# EAGLE board BMS_25 (EAGLE 9.6.2)
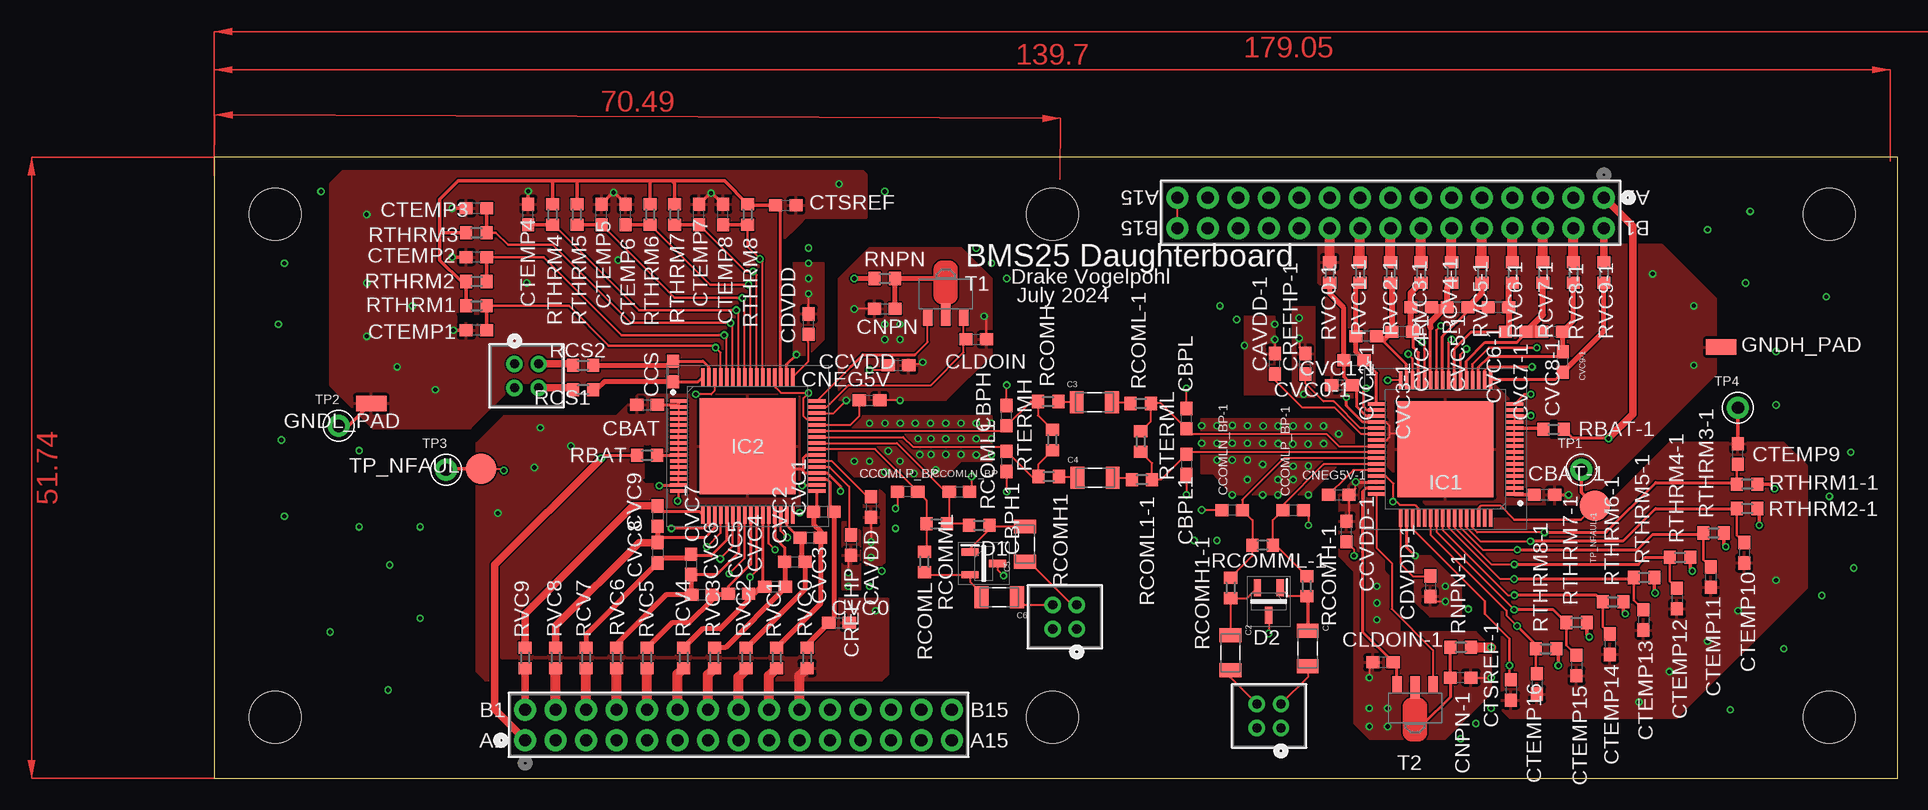
[diagram p1: board, top side]
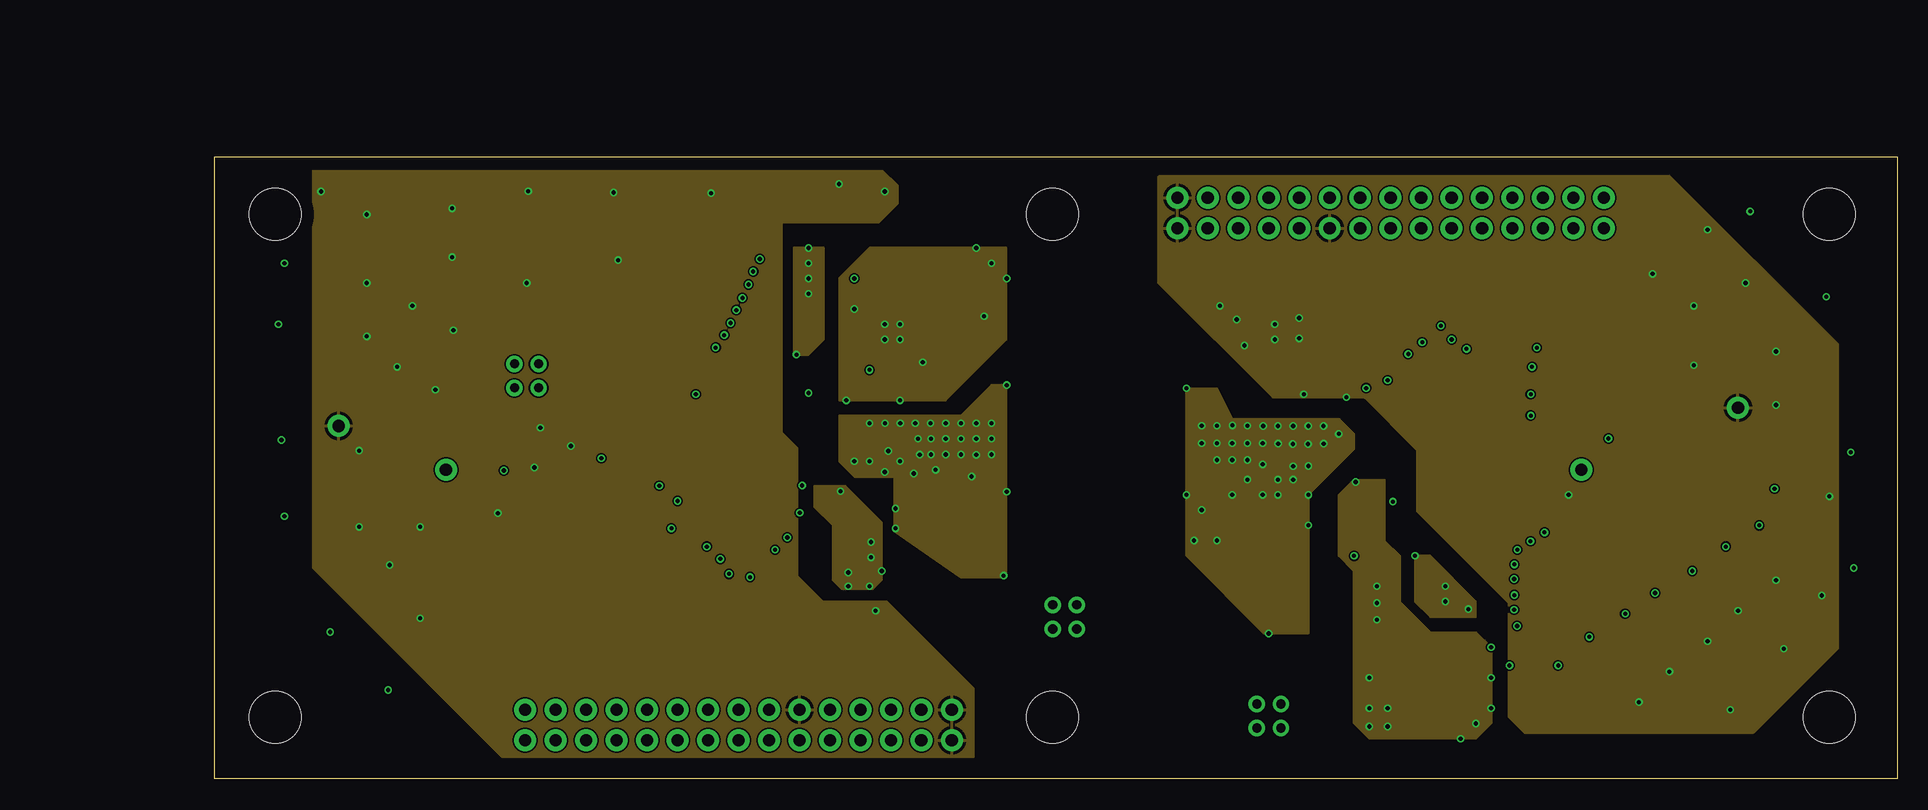
[diagram p2: board, inner layer Route2]
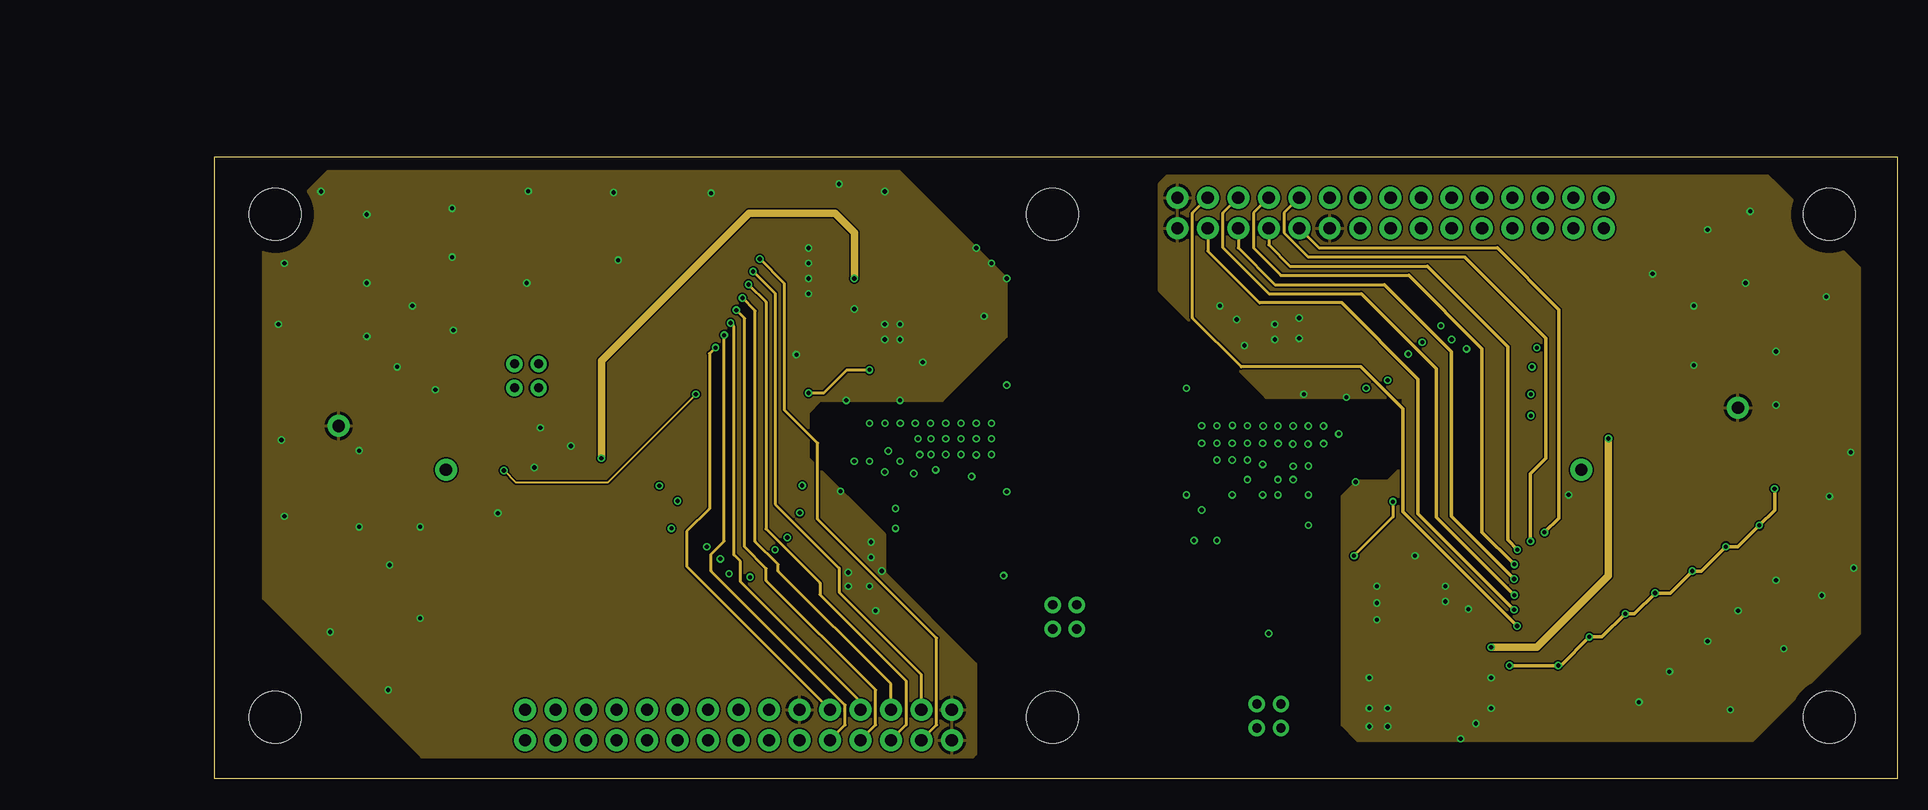
[diagram p3: board, inner layer Route15]
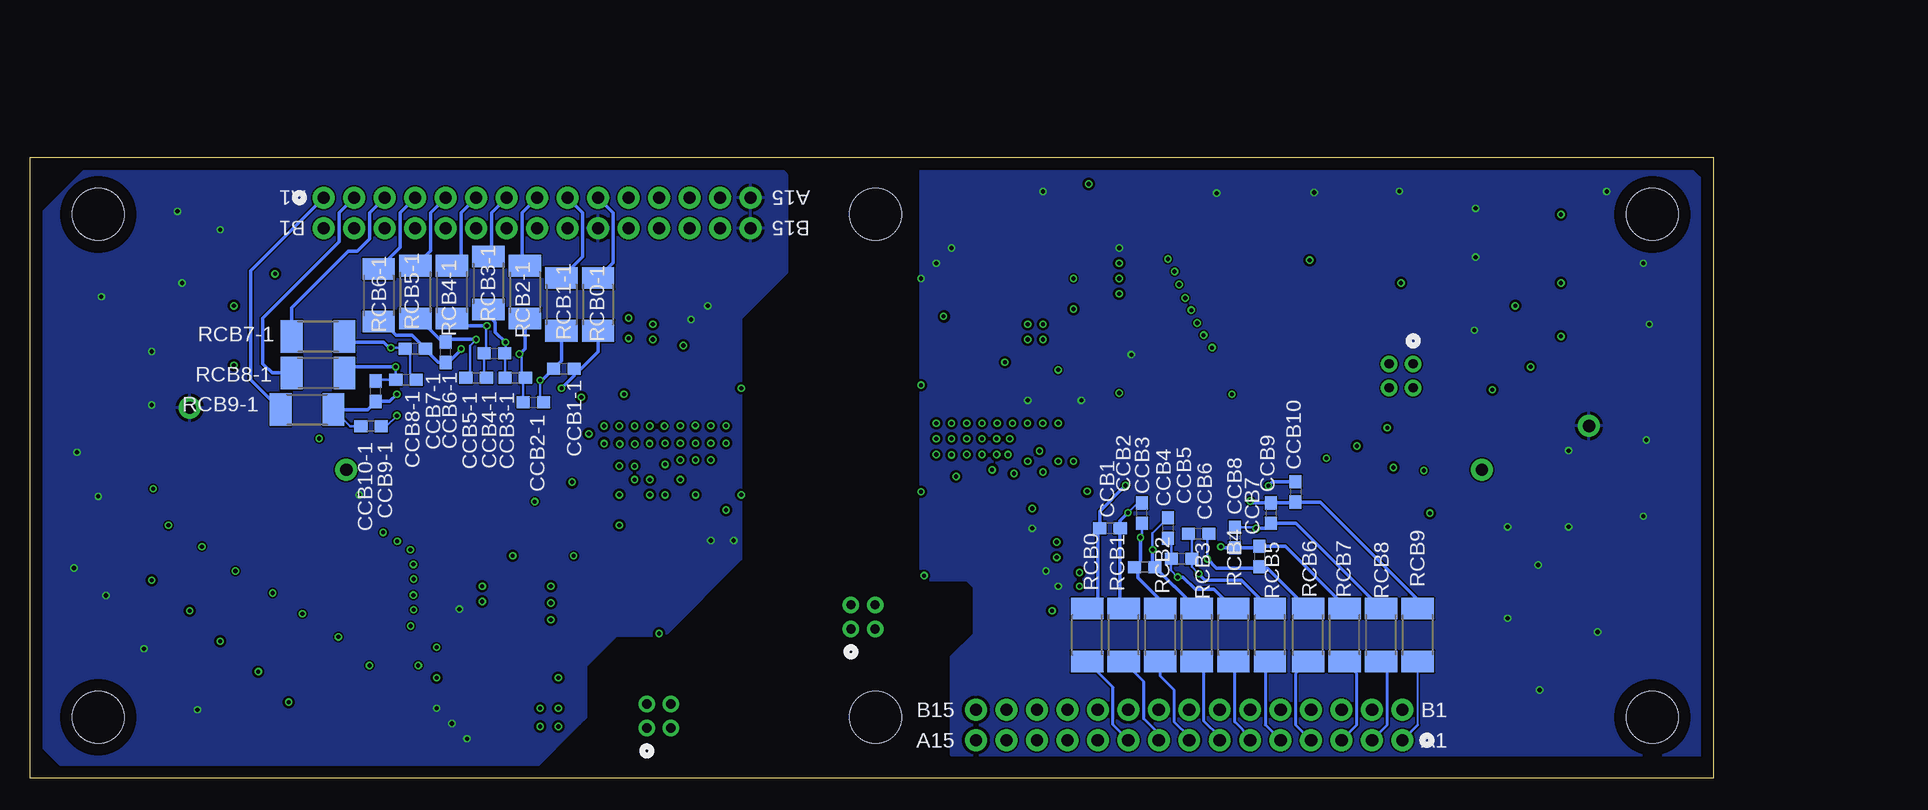
[diagram p4: board, bottom side, seen from below]

Size 140.31 x 51.74 mm. Coordinates in mm from the lower left corner, seen from the top.
Outline: 0,0 140.31,0 140.31,51.74 0,51.74 0,0
Copper layers (1+2*15+16): Top 0.035mm / dielectric 0.2mm / Route2 0.0175mm / dielectric 1.065mm / Route15 0.0175mm / dielectric 0.2mm / Bottom 0.035mm
Design rules "jlcpcb-4layers *": minimum track width 3.5mil, minimum drill 0.2mm, track to track 5mil, track to pad 0.2mm, pad to pad 5mil, via to via 0.5mm, smd to smd 5mil, copper to edge 40mil, drill to drill 6mil, minimum pad ring 10mil, minimum via ring 0.13mm, stop-mask expansion 0.05mm, vias tented up to drill 16mil, thermal gap 10mil
Holes 4.32 mm at 5.08,46.99 5.08,5.08 134.62,46.99 134.62,5.08 69.85,46.99 69.85,5.08
tRestrict: area 26.4,10.3 to 40.3,22.2; area 29,10.3 to 40.6,19.8; area 31.4,10.3 to 42.1,18.2; area 34.3,10.3 to 42.8,16.9; area 36.8,10.3 to 44.5,16.7; area 39.9,10.3 to 46.3,15.2; area 42.4,10.2 to 43.5,11.2; area 45,10.2 to 50.1,15.3; area 44.2,8.1 to 46.1,9.9; area 41.8,8.1 to 43.6,9.9; area 39.2,8.1 to 40.9,9.9; area 36.7,8.1 to 38.4,9.9; 10 more areas
bRestrict: area 58.2,29.3 to 58.7,29.8; area 59.4,29.3 to 59.9,29.8; area 60.7,29.3 to 61.2,29.8; area 62,29.3 to 62.5,29.8; area 63.2,29.3 to 63.8,29.8; area 64.5,29.3 to 65,29.8; area 64.5,28.1 to 65,28.6; area 55.6,29.3 to 56.1,29.8; area 56.9,29.3 to 57.4,29.8; area 54.4,29.3 to 54.9,29.8; area 60.7,28.1 to 61.2,28.6; area 62,28.1 to 62.5,28.6; 118 more areas

## Footprints (pad centres in the part's own frame; a part is rotated, then mirrored left to right if it is on the bottom)
CAPC3216X120N = smd 1.16 x 1.82: 1 -1.475,0; 2 1.475,0
C0603 = smd 1.1 x 1: 1 -0.85,0; 2 0.85,0
CON4_2X2_UF_DF11_HIR = drill 0.762 pad 1.27: 1 0,0; 2 0,2.007; 3 -2.007,0; 4 -2.007,2.007
SOT95P255X150-3N = smd 1.4 x 0.6: 1 -1.15,0.95; 2 -1.15,-0.95; 3 1.15,0
SMD1,27-2,54 = smd 1.27 x 2.54: 1 0,0
87606-315LF_AMP = drill 1.016 pad 1.524: 1 0,0; 2 2.54,0; 3 5.08,0; 4 7.62,0; 5 10.16,0; 6 12.7,0; 7 15.24,0; 8 17.78,0; 9 20.32,0; 10 22.86,0; 11 25.4,0; 12 27.94,0; 13 30.48,0; 14 33.02,0; 15 35.56,0; 16 0,2.54; 17 2.54,2.54; 18 5.08,2.54; 19 7.62,2.54; 20 10.16,2.54; 21 12.7,2.54; 22 15.24,2.54; 23 17.78,2.54; 24 20.32,2.54; 25 22.86,2.54; 26 25.4,2.54; 27 27.94,2.54; 28 30.48,2.54; 29 33.02,2.54; 30 35.56,2.54
QFP50P1200X1200X120-65N = smd 1.475 x 0.3: 1 -5.738,3.75; 2 -5.738,3.25; 3 -5.738,2.75; 4 -5.738,2.25; 5 -5.738,1.75; 6 -5.738,1.25; 7 -5.738,0.75; 8 -5.738,0.25; 9 -5.738,-0.25; 10 -5.738,-0.75; 11 -5.738,-1.25; 12 -5.738,-1.75; 13 -5.738,-2.25; 14 -5.738,-2.75; 15 -5.738,-3.25; 16 -5.738,-3.75; 33 5.738,-3.75; 34 5.738,-3.25; 35 5.738,-2.75; 36 5.738,-2.25; 37 5.738,-1.75; 38 5.738,-1.25; 39 5.738,-0.75; 40 5.738,-0.25; 41 5.738,0.25; 42 5.738,0.75; 43 5.738,1.25; 44 5.738,1.75; 45 5.738,2.25; 46 5.738,2.75; 47 5.738,3.25; 48 5.738,3.75 | smd 0.3 x 1.475: 17 -3.75,-5.738; 18 -3.25,-5.738; 19 -2.75,-5.738; 20 -2.25,-5.738; 21 -1.75,-5.738; 22 -1.25,-5.738; 23 -0.75,-5.738; 24 -0.25,-5.738; 25 0.25,-5.738; 26 0.75,-5.738; 27 1.25,-5.738; 28 1.75,-5.738; 29 2.25,-5.738; 30 2.75,-5.738; 31 3.25,-5.738; 32 3.75,-5.738; 49 3.75,5.738; 50 3.25,5.738; 51 2.75,5.738; 52 2.25,5.738; 53 1.75,5.738; 54 1.25,5.738; 55 0.75,5.738; 56 0.25,5.738; 57 -0.25,5.738; 58 -0.75,5.738; 59 -1.25,5.738; 60 -1.75,5.738; 61 -2.25,5.738; 62 -2.75,5.738; 63 -3.25,5.738; 64 -3.75,5.738 | smd 8 x 8: 65 0,0
R0603 = smd 1 x 1.1: 1 -0.85,0; 2 0.85,0
R2010 = smd 1.8 x 2.7: 1 -2.2,0; 2 2.2,0
SOT89-BCE = smd 0.8 x 1.4: B -1.499,-1.981; E 1.499,-1.981 | smd 0.8 x 1.9: C 0,-1.727
KEYSTONE_5002 = drill 1.02: TP 0,0
B2,54 = smd 2.54 x 2.54: TP 0,0

## Placement (x,y rotation side)
C1  C1206C105K5RACTU  [CAPC3216X120N]  91.14,10.82 270 top
C2  C1206C105K5RACTU  [CAPC3216X120N]  84.68,10.46 270 top
C3  C1206C105K5RACTU  [CAPC3216X120N]  73.36,31.34 0 top
C4  C1206C105K5RACTU  [CAPC3216X120N]  73.41,25.04 0 top
C5  C1206C105K5RACTU  [CAPC3216X120N]  67.56,19.51 90 top
C6  C1206C105K5RACTU  [CAPC3216X120N]  65.43,15.09 180 top
CAVDD  1uF  [C0603]  54.74,22.61 270 top
CAVDD-1  1uF  [C0603]  88.39,34.54 90 top
CBAT  10nF  [C0603]  36.07,31.11 0 top
CBAT-1  10nF  [C0603]  110.87,23.62 180 top
CBPH  220pF  [C0603]  66.04,30.23 90 top
CBPH1  220pF  [C0603]  66.04,26.42 270 top
CBPL  220pF  [C0603]  81.03,29.97 90 top
CBPL1  220pF  [C0603]  81.03,26.16 270 top
CCB1  0.47uF  [C0603]  50.29,20.83 180 bottom
CCB1-1  0.47uF  [C0603]  95.81,34.14 0 bottom
CCB2  0.47uF  [C0603]  47.62,22.1 90 bottom
CCB2-1  0.47uF  [C0603]  98.35,31.34 0 bottom
CCB3  0.47uF  [C0603]  47.4,17.6 180 bottom
CCB3-1  0.47uF  [C0603]  99.87,33.38 0 bottom
CCB4  0.47uF  [C0603]  45.44,20.85 90 bottom
CCB4-1  0.47uF  [C0603]  101.6,35.41 0 bottom
CCB5  0.47uF  [C0603]  44.32,18.29 180 bottom
CCB5-1  0.47uF  [C0603]  103.12,33.38 0 bottom
CCB6  0.47uF  [C0603]  42.9,20.37 180 bottom
CCB6-1  0.47uF  [C0603]  105.66,35.51 90 bottom
CCB7  0.47uF  [C0603]  37.85,18.49 270 bottom
CCB7-1  0.47uF  [C0603]  108.2,35.81 0 bottom
CCB8  0.47uF  [C0603]  39.88,20.07 270 bottom
CCB8-1  0.47uF  [C0603]  108.97,33.22 0 bottom
CCB9  0.47uF  [C0603]  36.88,22.1 270 bottom
CCB9-1  0.47uF  [C0603]  111.51,32.26 90 bottom
CCB10  0.47uF  [C0603]  34.82,23.88 270 bottom
CCB10-1  0.47uF  [C0603]  111.89,29.34 180 bottom
CCOMLN_BP  220pF  [C0603]  62.1,23.88 0 top
CCOMLN_BP-1  220pF  [C0603]  84.84,22.35 180 top
CCOMLP_BP  220pF  [C0603]  57.78,23.88 180 top
CCOMLP_BP-1  220pF  [C0603]  89.92,22.35 0 top
CCS  0.47uF  [C0603]  38.23,33.91 270 top
CCVDD  4.7uF  [C0603]  57.02,34.42 0 top
CCVDD-1  4.7uF  [C0603]  94.36,20.57 90 top
CDVDD  1uF  [C0603]  49.53,37.85 90 top
CDVDD-1  1uF  [C0603]  101.35,16 270 top
CLDOIN  0.1uF  [C0603]  63.5,36.58 0 top
CLDOIN-1  0.1uF  [C0603]  97.41,9.65 180 top
CNEG5V  0.1uF  [C0603]  54.61,31.5 0 top
CNEG5V-1  0.1uF  [C0603]  93.73,23.62 0 top
CNPN  0.22uF  [C0603]  55.88,39.12 0 top
CNPN-1  0.22uF  [C0603]  103.89,8.38 180 top
COMMH  DF11-4DP-2DSA(24)  [CON4_2X2_UF_DF11_HIR]  88.9,4.19 0 top
COMML  DF11-4DP-2DSA(24)  [CON4_2X2_UF_DF11_HIR]  71.88,12.45 0 top
CREFHP  1uF  [C0603]  53.09,19.43 270 top
CREFHP-1  1uF  [C0603]  90.93,34.54 90 top
CTEMP1  0.47uF  [C0603]  21.84,37.34 180 top
CTEMP2  0.47uF  [C0603]  21.84,43.43 180 top
CTEMP3  0.47uF  [C0603]  21.84,47.5 180 top
CTEMP4  0.47uF  [C0603]  26.16,46.99 90 top
CTEMP5  0.47uF  [C0603]  32.26,46.99 90 top
CTEMP6  0.47uF  [C0603]  34.29,46.99 90 top
CTEMP7  0.47uF  [C0603]  40.39,46.99 90 top
CTEMP8  0.47uF  [C0603]  42.42,46.99 90 top
CTEMP9  0.47uF  [C0603]  127,27.03 90 top
CTEMP10  0.47uF  [C0603]  127.51,18.8 270 top
CTEMP11  0.47uF  [C0603]  124.71,16.76 270 top
CTEMP12  0.47uF  [C0603]  121.92,14.99 270 top
CTEMP13  0.47uF  [C0603]  119.13,13.21 270 top
CTEMP14  0.47uF  [C0603]  116.33,11.18 270 top
CTEMP15  0.47uF  [C0603]  113.54,9.4 270 top
CTEMP16  0.47uF  [C0603]  110.24,7.87 270 top
CTSREF  1uF  [C0603]  47.62,47.75 0 top
CTSREF-1  1uF  [C0603]  108.08,7.37 270 top
CVC0  0.47uF  [C0603]  52.07,12.95 0 top
CVC0-1  0.47uF  [C0603]  93.98,32.77 180 top
CVC1  0.47uF  [C0603]  50.8,22.23 0 top
CVC1-1  0.47uF  [C0603]  95,34.82 180 top
CVC2  0.47uF  [C0603]  49.66,20.07 0 top
CVC2-1  0.47uF  [C0603]  96.01,36.86 180 top
CVC3  0.47uF  [C0603]  48.39,18.03 0 top
CVC3-1  0.47uF  [C0603]  99.01,37.21 180 top
CVC4  0.47uF  [C0603]  46.74,15.98 0 top
CVC4-1  0.47uF  [C0603]  100.58,39.24 180 top
CVC5  0.47uF  [C0603]  43.69,15.37 0 top
CVC5-1  0.47uF  [C0603]  103.63,39.24 180 top
CVC6  0.47uF  [C0603]  40.64,15.32 0 top
CVC6-1  0.47uF  [C0603]  107.04,39.24 180 top
CVC7  0.47uF  [C0603]  39.75,17.83 270 top
CVC7-1  0.47uF  [C0603]  108.46,37.21 180 top
CVC8  0.47uF  [C0603]  36.96,18.8 270 top
CVC8-1  0.47uF  [C0603]  111.51,37.21 180 top
CVC9  0.47uF  [C0603]  36.96,21.84 270 top
CVC9-1  0.47uF  [C0603]  112.39,34.7 90 top
D1  ESDAVLC6-2BLY  [SOT95P255X150-3N]  64.14,17.91 0 top
D2  ESDAVLC6-2BLY  [SOT95P255X150-3N]  87.88,14.73 270 top
GNDH_PAD  [SMD1,27-2,54]  125.6,35.94 270 top
GNDL_PAD  [SMD1,27-2,54]  13.08,31.24 90 top
HIGH-IN  87606-315LF  [87606-315LF_AMP]  115.82,48.39 180 top
IC1  PBQ79656PAPTQ1  [QFP50P1200X1200X120-65N]  102.62,27.43 180 top
IC2  PBQ79656PAPTQ1  [QFP50P1200X1200X120-65N]  44.45,27.69 0 top
LOW-IN  87606-315LF  [87606-315LF_AMP]  25.91,3.17 0 top
RBAT  30  [R0603]  36.07,26.92 0 top
RBAT-1  30  [R0603]  111.63,29.08 180 top
RCB0  10  [R2010]  52.2,11.94 90 bottom
RCB0-1  10  [R2010]  92.96,39.5 270 bottom
RCB1  10  [R2010]  49.15,11.94 90 bottom
RCB1-1  10  [R2010]  96.01,39.5 270 bottom
RCB2  10  [R2010]  46.1,11.94 90 bottom
RCB2-1  10  [R2010]  99.06,40.51 270 bottom
RCB3  10  [R2010]  43.05,11.94 90 bottom
RCB3-1  10  [R2010]  102.11,41.27 270 bottom
RCB4  10  [R2010]  40.01,11.94 90 bottom
RCB4-1  10  [R2010]  105.16,40.51 270 bottom
RCB5  10  [R2010]  36.96,11.94 90 bottom
RCB5-1  10  [R2010]  108.2,40.51 270 bottom
RCB6  10  [R2010]  33.78,11.94 90 bottom
RCB6-1  10  [R2010]  111.25,40.26 270 bottom
RCB7  10  [R2010]  30.73,11.94 90 bottom
RCB7-1  10  [R2010]  116.31,36.83 0 bottom
RCB8  10  [R2010]  27.69,11.94 90 bottom
RCB8-1  10  [R2010]  116.31,33.78 0 bottom
RCB9  10  [R2010]  24.64,11.94 90 bottom
RCB9-1  10  [R2010]  117.22,30.73 0 bottom
RCOMH  49  [R0603]  69.49,31.39 180 top
RCOMH1  49  [R0603]  69.55,25.15 180 top
RCOMH1-1  49  [R0603]  84.71,15.88 90 top
RCOMH-1  49  [R0603]  91.06,16 90 top
RCOML  49  [R0603]  59.18,18.03 90 top
RCOML1  49  [R0603]  63.75,21.08 180 top
RCOML1-1  49  [R0603]  77.32,24.89 0 top
RCOML-1  49  [R0603]  77.22,31.24 0 top
RCOMML  1k  [R0603]  60.2,21.21 0 top
RCOMML-1  1k  [R0603]  87.38,19.43 0 top
RCS1  10  [R0603]  30.73,32.38 180 top
RCS2  10  [R0603]  30.73,34.42 180 top
RCV4  100  [R0603]  39.12,10.03 90 top
RCV4-1  100  [R0603]  103.12,42.16 270 top
RCV7  100  [R0603]  30.99,10.03 90 top
RCV7-1  100  [R0603]  110.74,42.16 270 top
RNPN  49?  [R0603]  55.88,41.66 0 top
RNPN-1  49?  [R0603]  103.89,10.92 180 top
RTERMH  1k  [R0603]  69.85,28.19 90 top
RTERML  1k  [R0603]  77.22,28.07 270 top
RTHRM1  10k  [R0603]  21.84,39.37 0 top
RTHRM1-1  10k  [R0603]  127.76,24.51 180 top
RTHRM2  10k  [R0603]  21.84,41.4 0 top
RTHRM2-1  10k  [R0603]  127.76,22.48 180 top
RTHRM3  10k  [R0603]  21.84,45.47 0 top
RTHRM3-1  10k  [R0603]  124.97,20.45 180 top
RTHRM4  10k  [R0603]  28.19,46.99 270 top
RTHRM4-1  10k  [R0603]  122.17,18.41 180 top
RTHRM5  10k  [R0603]  30.23,46.99 270 top
RTHRM5-1  10k  [R0603]  119.18,16.74 180 top
RTHRM6  10k  [R0603]  36.32,46.99 270 top
RTHRM6-1  10k  [R0603]  116.59,14.71 180 top
RTHRM7  10k  [R0603]  38.35,46.99 270 top
RTHRM7-1  10k  [R0603]  113.54,12.98 180 top
RTHRM8  10k  [R0603]  44.45,46.99 270 top
RTHRM8-1  10k  [R0603]  111,10.79 180 top
RVC0  100  [R0603]  49.4,10.03 90 top
RVC0-1  100  [R0603]  92.96,42.16 270 top
RVC1  100  [R0603]  46.86,10.03 90 top
RVC1-1  100  [R0603]  95.5,42.16 270 top
RVC2  100  [R0603]  44.32,10.03 90 top
RVC2-1  100  [R0603]  98.04,42.16 270 top
RVC3  100  [R0603]  41.68,10.03 90 top
RVC3-1  100  [R0603]  100.58,42.16 270 top
RVC5  100  [R0603]  36.07,10.03 90 top
RVC5-1  100  [R0603]  105.66,42.16 270 top
RVC6  100  [R0603]  33.53,10.03 90 top
RVC6-1  100  [R0603]  108.2,42.16 270 top
RVC8  100  [R0603]  28.45,10.03 90 top
RVC8-1  100  [R0603]  113.28,42.16 270 top
RVC9  100  [R0603]  25.91,10.03 90 top
RVC9-1  100  [R0603]  115.82,42.16 270 top
SR  DF11-4DP-2DSA(24)  [CON4_2X2_UF_DF11_HIR]  25.02,34.54 180 top
T1  PBHV8115X, 115  [SOT89-BCE]  60.96,40.39 0 top
T2  PBHV8115X, 115  [SOT89-BCE]  100.08,5.84 180 top
TP1  5002  [KEYSTONE_5002]  113.94,25.7 0 top
TP2  5002  [KEYSTONE_5002]  10.36,29.36 0 top
TP3  5002  [KEYSTONE_5002]  19.3,25.7 0 top
TP4  5002  [KEYSTONE_5002]  127,30.89 0 top
TP_NFAUL  TPB2,54  [B2,54]  22.23,25.78 180 top
TP_NFAUL-1  TPB2,54  [B2,54]  115.06,22.73 0 top

## Tracks (layer width: path | path; a pad name or v marks a point on that pad's centre or on a via)
AVDD
  Top 0.152: IC2.38 51.47,26.44 54.44,23.46 CAVDD.1
AVDD-1
  Top 0.152: IC1.38 95.61,28.68 93.38,30.9 90.68,30.9 88.39,33.19 CAVDD-1.1
BAT  (via drill 0.35)
  Top 0.254: v32.26,26.67 32.51,26.92 RBAT.1
  Top 0.406: v53.34,41.66 RNPN.1
  Top 0.61: v32.26,26.67 23.37,17.78 23.37,5.77 25.91,3.23 LOW-IN.1
  Route15 0.61: v32.26,26.67 32.26,34.8 44.55,47.09 51.71,47.09 53.34,45.47 v53.34,41.66
  Bottom 0.152: 24.64,4.45 RCB9.1
  Bottom 0.254: LOW-IN.1 24.64,4.45
BAT-1  (via drill 0.35)
  Top 0.254: RBAT-1.1 113.25,28.32 v116.2,28.32
  Top 0.61: v116.2,28.32 118.24,30.35 118.24,46.02 115.88,48.39 HIGH-IN.1
  Top 0.813: RNPN-1.1 v106.43,10.92
  Route15 0.61: v106.43,10.92 110.24,10.92 116.2,16.89 v116.2,28.32
  Bottom 0.305: HIGH-IN.1 121.92,42.29 121.92,33.23 RCB9-1.1
CB0  (via drill 0.35)
  Top 0.2: IC2.34 49.02,24.44 v49,24.41
  Bottom 0.152: 51.14,21.04 CCB1.2
  Bottom 0.305: RCB0.2 51.31,15.03 51.31,20.66 CCB1.2 | 51.14,21.04 51.14,22.26 v49,24.41
CB0-1  (via drill 0.35)
  Top 0.203: v96.01,32.51 95.76,32.26 95.76,30.99 96.06,30.68 IC1.34
  Bottom 0.305: RCB0-1.2 92.96,35.56 94.39,34.14 CCB1-1.2 94.96,33.56 v96.01,32.51
CB0-IN
  Bottom 0.254: LOW-IN.10 50.04,4.45 50.04,7.58 RCB0.1
CB0-IN-1
  Bottom 0.305: RCB0-1.1 91.7,42.96 91.7,44.2 91.7,47.12 HIGH-IN.10
CB1  (via drill 0.35)
  Top 0.2: IC2.32 48.38,22.13 v48.79,22.13 v48.79,22.12
  Bottom 0.203: v48.79,22.12 47.97,22.95 CCB2.2
  Bottom 0.305: v48.79,22.12 49.44,21.48 CCB1.1 49.44,14.43 RCB1.2
CB1-1  (via drill 0.35)
  Top 0.152: IC1.32 v97.79,33.17
  Bottom 0.203: CCB2-1.2 97.8,31.65 97.8,33.16 v97.79,33.17
  Bottom 0.305: v97.79,33.17 97.62,33.17 CCB1-1.1 96.01,34.78 RCB1-1.2
CB1-IN
  Bottom 0.254: LOW-IN.9 46.23,3.71 47.47,4.95 47.47,8.06 RCB1.1
CB1-IN-1
  Bottom 0.305: RCB1-1.1 94.24,43.47 94.24,47.12 HIGH-IN.9
CB2  (via drill 0.35)
  Top 0.2: IC2.30 47.2,20.62 v47.75,20.07
  Bottom 0.203: v47.75,20.07 47.62,20.19 CCB2.1
  Bottom 0.305: RCB2.2 46.1,14.86 47.94,16.7 47.94,17.3 CCB3.2 47.75,18.1 v47.75,20.07
CB2-1  (via drill 0.35)
  Top 0.203: v99.52,35.36 99.52,35.3 99.87,34.95 IC1.30
  Bottom 0.203: CCB2-1.1 99.2,33.2 CCB3-1.2 99.33,33.68 99.33,35.17 v99.52,35.36
  Bottom 0.305: v99.52,35.36 99.06,35.81 RCB2-1.2
CB2-IN
  Bottom 0.254: LOW-IN.8 43.69,3.45 44.93,4.69 44.93,7.34 46.1,8.51 RCB2.1
CB2-IN-1
  Bottom 0.305: RCB2-1.1 99.31,42.97 99.31,47.12 HIGH-IN.8
CB3  (via drill 0.35)
  Top 0.2: IC2.28 46.2,19.59 v46.74,19.05
  Bottom 0.203: v46.74,19.05 46.74,20.41 CCB4.2
  Bottom 0.305: v46.74,19.05 46.74,17.79 CCB3.1 44.95,16 44.92,16 RCB3.2
CB3-1  (via drill 0.35)
  Top 0.203: v100.68,36.34 100.87,36.16 IC1.28
  Bottom 0.203: v100.68,36.34 100.68,35.48 CCB4-1.2 100.72,35.38 CCB3-1.1
  Bottom 0.305: v100.68,36.34 101.53,37.19 101.53,38.01 102.11,38.59 RCB3-1.2
CB3-IN
  Bottom 0.254: LOW-IN.7 41.15,3.45 42.45,4.75 42.45,9.13 RCB3.1
CB3-IN-1
  Bottom 0.305: RCB3-1.1 101.85,43.73 101.85,47.12 HIGH-IN.7
CB4  (via drill 0.35)
  Top 0.2: IC2.26 45.2,17.31 v44.65,16.76
  Bottom 0.203: v44.65,16.76 45.21,17.32 45.21,18.25 CCB5.2 45.17,19.74 CCB4.1
  Bottom 0.305: RCB4.2 41.62,15.75 43.18,15.75 44.2,16.76 v44.65,16.76
CB4-1  (via drill 0.35)
  Top 0.152: IC1.26 101.87,33.96
  Top 0.203: 101.87,33.96 101.87,37.34 v102.24,37.72
  Bottom 0.203: v102.24,37.72 102.29,37.66 102.29,35.57 | CCB5-1.2 102.45,33.55 CCB4-1.1
  Bottom 0.305: v102.24,37.72 104.56,37.72 RCB4-1.2 | 102.29,35.57 CCB4-1.1
CB4-IN
  Bottom 0.254: LOW-IN.6 38.61,3.43 39.88,4.7 39.88,9.61 RCB4.1
CB4-IN-1
  Bottom 0.305: RCB4-1.1 104.39,43.48 104.39,47.12 HIGH-IN.6
CB5  (via drill 0.35)
  Top 0.2: IC2.24 44.2,18.34 v42.9,17.04
  Bottom 0.203: v42.9,17.04 43.47,17.61 CCB5.1 43.47,20.09 CCB6.2
  Bottom 0.305: RCB5.2 39.33,16.51 42.37,16.51 v42.9,17.04
CB5-1  (via drill 0.35)
  Top 0.203: v103.12,36.58 102.87,36.32 IC1.24
  Bottom 0.203: CCB5-1.1 103.63,33.72 103.63,36.07 v103.12,36.58
  Bottom 0.305: v103.12,36.58 105.45,36.58 CCB6-1.2 105.86,36.55 106.14,36.55 107.9,38.31 RCB5-1.2
CB5-IN
  Bottom 0.254: LOW-IN.5 37.34,4.45 37.34,9.36 RCB5.1
CB5-IN-1
  Bottom 0.305: RCB5-1.1 106.93,43.98 106.93,47.12 HIGH-IN.5
CB6  (via drill 0.35)
  Top 0.2: IC2.22 43.2,19.32 v42.16,18.29
  Bottom 0.203: v42.16,18.29 42.16,20.26 CCB6.1
  Bottom 0.305: RCB6.2 37.17,17.53 37.73,17.53 CCB7.2 37.96,17.53 41.4,17.53 v42.16,18.29
CB6-1  (via drill 0.35)
  Top 0.152: IC1.22 103.87,33.96
  Top 0.203: 103.87,33.96 103.87,35.28 v104.37,35.79
  Bottom 0.305: RCB6-1.2 110.95,38.06 109.8,36.91 108.45,36.91 CCB7-1.2 107.35,35.73 106.29,34.66 CCB6-1.1 105.41,34.66 104.37,35.7 v104.37,35.79
CB6-IN
  Bottom 0.254: RCB6.1 34.83,8.69 34.83,4.47 LOW-IN.4
CB6-IN-1
  Bottom 0.305: RCB6-1.1 109.47,44.24 109.47,47.12 HIGH-IN.4
CB7  (via drill 0.35)
  Top 0.2: IC2.20 42.2,20.45 v41.05,19.3
  Bottom 0.305: RCB7.2 30.73,14.39 35.68,19.34 CCB7.1 37.97,19.22 CCB8.2 40.97,19.22 v41.05,19.3
CB7-1  (via drill 0.35)
  Top 0.203: v110.24,35.88 106.24,35.88 104.87,34.5 IC1.20
  Bottom 0.203: v110.24,35.88 109.12,35.88 CCB7-1.1 108.62,35.38 108.62,33.73 CCB8-1.2
  Bottom 0.305: v110.24,35.88 110.31,35.8 110.83,36.32 113.6,36.32 RCB7-1.2
CB7-IN
  Bottom 0.254: LOW-IN.3 29.72,4.45 29.72,8.72 RCB7.1
CB7-IN-1
  Bottom 0.305: HIGH-IN.3 112.01,47.12 112.01,44.96 113.03,43.94 113.79,43.94 118.51,39.23 RCB7-1.1
CB8  (via drill 0.35)
  Top 0.2: IC2.18 41.2,21.13 40.89,20.83 v38.1,20.83
  Bottom 0.203: v38.1,20.83 38.19,20.92 CCB8.1
  Bottom 0.305: v38.1,20.83 37.3,20.83 CCB9.2 34.8,21.25 RCB8.2
CB8-1  (via drill 0.35)
  Top 0.152: IC1.18 105.87,33.96
  Top 0.203: 105.87,33.96 105.87,33.98 106.17,34.29 v109.83,34.29
  Bottom 0.203: CCB9-1.2 111.39,33.22 CCB8-1.1 109.82,34.28 v109.83,34.29
  Bottom 0.305: v109.83,34.29 113.6,34.29 RCB8-1.2
CB8-IN
  Bottom 0.254: LOW-IN.2 27.18,4.45 27.18,9.23 RCB8.1
CB8-IN-1
  Bottom 0.305: HIGH-IN.2 114.55,47.12 114.55,44.7 120.9,38.35 120.9,34.54 120.14,33.78 RCB8-1.1
CB9  (via drill 0.35)
  Top 0.2: IC2.16 38.71,23.22 v38.61,23.11
  Bottom 0.305: v38.61,23.11 38.44,22.95 CCB9.1 34.9,22.95 CCB10.2 32.76,23.03 24.64,14.9 RCB9.2
CB9-1  (via drill 0.35)
  Top 0.203: IC1.16 109.18,32 v109.73,32
  Bottom 0.203: RCB9-1.2 113.62,29.34 CCB10-1.2
  Bottom 0.305: v109.73,32 110.32,31.41 CCB9-1.1 112.18,30.73 RCB9-1.2
COMHN
  Top 0.152: RTERMH.1 68.69,26.19 RCOMH1.2 68.16,25.15 CBPH1.1 65.67,27.64 58.22,27.64 57.42,28.44 IC2.42
COMHN-1
  Top 0.152: IC1.42 89.17,26.68 85.69,23.2 CCOMLN_BP-1.1 86.53,21.51 RCOMML-1.1 86.53,18.54 RCOMH1-1.2
COMHP
  Top 0.152: RTERMH.2 68.64,30.25 RCOMH.2 68.06,31.39 CBPH.1 65.6,28.94 IC2.43
COMHP-1
  Top 0.152: IC1.43 96.86,26.16 92.46,26.16 89.07,22.77 CCOMLP_BP-1.1 88.23,21.51 RCOMML-1.2 88.48,19.43 RCOMH-1.2
COMLN
  Top 0.152: IC2.41 56.9,27.94 61.11,23.73 CCOMLN_BP.1 61.25,21.25 61.21,21.21 | RCOML1.2 62.78,21.21 61.21,21.21 | 61.21,21.21 RCOMML.2
COMLN-1
  Top 0.152: RTERML.2 78.17,26.27 RCOML1-1.2 78.91,24.89 CBPL1.1 81.2,27.18 IC1.41
COMLP
  Top 0.152: IC2.40 55.08,27.44 CCOMLP_BP.1 59.35,23.16 RCOMML.1 59.35,19.05 RCOML.2
COMLP-1
  Top 0.152: RTERML.1 78.07,29.77 RCOML-1.2 78.91,31.24 CBPL.1 81.45,28.7 92.71,28.7 93.73,27.68 IC1.40
CVDD  (via drill 0.35)
  Top 0.152: IC2.45 49.36,29.93 49.09,30.19 49.09,31.68 v49.53,32.12 | CCVDD.1 55.79,34.04 v54.61,34.04 | v49.53,32.12 | IC2.52 46.77,33.35 46.77,32.57 47.23,32.12 v49.53,32.12
  Route15 0.254: v49.53,32.12 50.8,32.12 52.72,34.04 v54.61,34.04
CVDD-1  (via drill 0.35)
  Top 0.152: 98.29,23.24 98.29,24.56 97.67,25.18 IC1.45 | IC1.52 100.37,22.48 100.06,22.79 98.81,22.79 98.32,23.27 98.29,23.24 | CCVDD-1.1 95,19.09 v95,18.54 | v98.24,23.06 98.24,23.19 98.29,23.24
  Route15 0.254: v95,18.54 98.24,21.79 v98.24,23.06
DVDD
  Top 0.152: IC2.49 49.47,34.69 49.47,36.37 CDVDD.1
DVDD-1
  Top 0.152: IC1.49 98.87,17.89 99.9,16.85 CDVDD-1.1
GNDH  (via drill 0.35)
  Top 0.152: 97.95,28.7 97.95,29.4 97.67,29.68 IC1.36 | 97.95,28.7 97.95,28.41 97.72,28.18 IC1.39 | 97.95,28.7 98.81,28.7 100.08,27.43 IC1.65 | v95.12,24.69 95.12,24.17 CNEG5V-1.2 94.58,21.64 CCVDD-1.2 | CNPN-1.1 v106.43,8.38 | v102.62,14.73 101.77,14.73 CDVDD-1.2 | v90.42,36.66 90.42,35.9 CREFHP-1.2 | CBPL1.2 v81.03,23.62 | CCOMLN_BP-1.2 v82.3,22.35 | CCOMLP_BP-1.2 91.19,21.93 v91.19,21.08 | v88.39,36.58 CAVDD-1.2 | D2.3 v87.88,12.06 | CBPL.2 v81.03,32.51 | CLDOIN-1.2 96.27,9.36 v96.27,8.38 | HIGH-IN.30 HIGH-IN.15
  Top 0.254: IC1.36 95.74,29.68 94.36,31.06 v94.36,31.75 | IC1.46 v95.13,24.68 v95.12,24.69 | IC1.50 99.37,19.25 v100.08,18.54 | CBAT-1.1 v112.88,23.62
  Top 0.305: CTEMP9.2 TP4.TP
  Top 0.813: RVC0-1.1 HIGH-IN.25
  other vias: 84.86,29.41 86.11,29.39 83.57,29.39 82.3,29.39 88.65,29.37 89.92,29.37 91.18,29.37 86.11,26.52 84.84,26.52 83.57,26.52 82.3,27.92 83.57,27.92 87.38,26.16 86.11,24.89 84.84,23.62 84.84,27.92 86.11,27.92 87.43,29.36 88.67,27.89 89.89,27.86 87.38,27.92 92.45,29.37 91.16,27.86 92.46,27.89 87.38,23.62 88.65,24.89 89.92,26 89.92,24.89 88.65,23.62 91.19,26.02 91.19,23.62 104.52,14.1 85.22,38.23 85.85,36.07 88.39,37.85 90.42,38.35 90.81,32 106.43,5.84 105.16,4.57 102.62,16 103.89,3.3 96.9,13.21 96.9,14.61 96.9,16 96.27,5.84 97.79,5.84 97.79,4.32 96.27,4.32 93.73,28.7 81.66,19.81 83.57,19.81 118.75,6.35 121.28,8.89 124.46,11.43 126.36,5.71 130.81,10.79 133.99,15.24 130.18,16.51 127,13.97 134.62,23.5 130.18,31.11 123.32,34.42 123.32,39.37 130.18,35.56 127.64,41.27 119.89,42.04 124.46,45.72 83.82,39.37 136.65,17.53 136.4,27.18 134.37,40.13 128.02,47.24
  pour Top: 89.92,31.75 89.92,39.31 91.69,39.31 91.69,31.75
  pour Top: 88.39,32 88.39,38.48 85.85,38.48 85.85,32
  pour Top: 82.3,29.97 93.73,29.97 95,28.7 95,27.43 91.19,23.62 84.86,23.62 83.31,25.4 82.3,25.4
  pour Top: 95,24.89 93.73,23.62 93.73,18.54 95,17.27 95,4.57 96.27,3.3 102.62,3.3 106.43,7.11 106.43,10.92 105.16,12.19 98.81,12.19 98.81,16 97.54,17.27 97.54,24.89
  pour Top: 100.08,18.54 101.35,18.54 103.89,16 103.89,13.46 101.35,13.46 100.08,14.73
  pour Route2: 100.08,18.54 100.08,14.73 101.35,13.46 105.16,13.46 105.16,14.73 101.35,18.54
  pour Route2: 105.16,12.19 106.43,10.92 106.43,4.57 105.16,3.3 96.27,3.3 95,4.57 95,17.27 93.73,18.54 93.73,23.62 95,24.89 97.54,24.89 97.54,19.81 98.81,18.54 98.81,14.73 101.35,12.19
  pour Route2: 81.03,32.51 83.57,32.51 84.84,29.97 93.73,29.97 95,28.7 95,27.43 91.19,23.62 91.19,12.06 87.5,12.06 81.03,18.54
  pour Top: 100.97,21.59 100.97,20.95 107.31,14.61 107.31,5.71 107.95,5.08 121.92,5.08 132.72,15.88 132.72,26.04 130.81,27.94 121.28,27.94 114.94,21.59
  pour Top: 113.67,22.86 100.97,22.86 97.16,26.67 97.16,30.48 95.89,31.75 92.71,31.75 92.71,40.64 92.08,41.27 92.08,44.45 120.65,44.45 125.09,40.01 125.09,33.66 116.2,24.77 114.3,22.86
  pour Route2: 95.89,31.75 88.27,31.75 78.74,41.27 78.74,50.16 121.28,50.16 135.25,36.2 135.25,10.79 128.27,3.81 109.22,3.81 107.95,5.08 107.95,14.61 100.33,22.23 100.33,27.3
  pour Route15: 96.52,3.17 128.27,3.17 137.16,12.06 137.16,42.55 130.18,49.53 129.54,50.16 79.38,50.16 78.74,49.53 78.74,40.64 87.63,31.75 99.06,31.75 99.06,26.04 97.79,24.77 95.25,24.77 93.98,23.5 93.98,4.45 95.25,3.17
  pour Bottom: 81.03,18.54 81.03,38.35 79.76,39.62 77.22,42.16 77.22,50.29 77.72,50.8 85.09,50.8 135.64,50.8 139.95,46.48 139.95,3.3 137.16,0.51 98.55,0.51 94.49,4.57 93.98,5.08 93.98,9.4 91.44,11.94 87.38,11.94 81.03,18.29
GNDL  (via drill 0.35)
  Top 0.152: CNPN.1 v53.34,39.12 | CLDOIN.2 64.35,38.32 v64.16,38.51 | v57.15,31.5 CNEG5V.2 | CCVDD.2 57.96,34.5 58.88,34.5 v59.05,34.67 | IC2.46 51.62,30.44 v52.68,31.5 | CDVDD.2 v49.53,40.39 | v56.77,22.48 56.94,22.64 CCOMLP_BP.2 | CCOMLN_BP.2 63.12,24.04 v63.12,25.15 | D1.3 65.28,17.39 v65.79,16.89 | CBPH.2 v66.04,32.77 | CBPH1.2 v66.04,23.88 | CREFHP.2 52.83,18.33 v52.83,17.14 | CAVDD.2 v54.74,19.68 | IC2.65 45.09,27.69 46.99,25.78
  Top 0.254: IC2.50 47.7,34.49 v48.51,35.31 | v52.2,23.93 52.2,24.34 51.1,25.44 IC2.36 49.23,25.43 49.12,25.54 | 49.12,25.54 49.12,26.72 49.34,26.94 IC2.39 | 49.12,25.54 48.88,25.78 46.99,25.78
  Top 0.305: CTEMP1.2 v19.91,37.34 | CTEMP2.2 v19.81,43.43 | CTEMP3.2 v19.81,47.5 | v26.16,48.92 CTEMP4.2 | CTEMP5.2 33.24,48.82 v33.27,48.82 33.31,48.82 CTEMP6.2 | CTEMP7.2 41.31,48.77 v41.4,48.77 41.49,48.77 CTEMP8.2 | GNDL_PAD.1 11.2,29.36 TP2.TP
  Top 0.813: RVC0.1 48.77,8.55 LOW-IN.25
  other vias: 58.42,29.59 59.69,29.59 60.96,29.59 62.23,29.59 63.5,29.59 64.77,29.59 58.65,28.29 59.74,28.29 60.96,28.29 62.23,28.29 63.5,28.29 64.77,28.29 49.53,41.66 55.88,36.58 55.88,37.85 57.15,37.85 57.15,36.58 57.18,29.59 55.91,29.59 54.61,29.59 63.5,26.95 62.23,26.98 60.96,26.98 59.74,26.98 58.8,26.97 64.77,26.98 60.12,25.7 54.61,26.42 53.34,26.42 55.88,25.53 58.29,25.4 57.15,26.42 56.17,27.28 52.83,16 54.74,18.41 49.53,42.93 49.53,44.2 63.5,44.2 64.77,42.93 66.04,41.66 56.77,20.83 54.61,16 55.63,17.27 55.12,13.97 23.62,22.1 26.67,25.91 29.72,27.69 27.18,29.21 18.41,32.38 15.24,34.29 12.7,36.83 16.51,39.37 12.7,41.27 26.04,41.27 12.7,46.99 33.66,43.18 52.07,49.53 17.14,13.34 14.61,17.78 12.06,20.95 17.14,20.95 12.06,27.3 8.89,48.9 55.88,48.9 14.48,7.37 9.65,12.19 5.84,21.84 5.59,28.19 5.33,37.85 5.84,42.93
  pour Top: 48.26,35.31 49.53,35.31 50.8,36.58 50.8,42.93 48.26,42.93
  pour Top: 52.07,31.5 52.07,41.66 54.61,44.2 62.23,44.2 64.77,41.66 64.77,35.31 60.96,31.5
  pour Top: 52.07,26.42 52.07,30.23 64.77,30.23 64.77,26.42 62.23,26.42 60.96,25.15 53.34,25.15
  pour Route2: 48.26,35.31 49.53,35.31 50.8,36.58 50.8,44.2 48.26,44.2
  pour Route2: 52.07,41.66 52.07,31.5 60.96,31.5 66.04,36.58 66.04,44.2 54.61,44.2
  pour Route2: 66.04,16.76 66.04,32.77 64.77,32.77 62.23,30.23 52.07,30.23 52.07,26.42 53.34,25.15 56.64,25.15 56.64,20.62 62.25,16.76
  pour Top: 52.32,21.34 52.32,15.75 53.85,15.75 53.85,20.57 53.09,21.34
  pour Top: 54.1,23.62 54.1,18.03 54.36,17.78 55.63,17.78 55.88,18.03 55.88,23.62 55.12,24.38 54.36,24.38 54.1,24.13
  pour Route2: 50.04,24.38 52.58,24.38 55.63,21.34 55.63,16.51 54.86,15.75 52.32,15.75 51.56,16.51 51.56,21.08 50.04,22.61
  pour Top: 56.13,14.99 56.13,8.64 55.63,8.13 22.61,8.13 21.84,8.89 21.84,27.94 24.13,30.23 33.53,30.23 35.31,32 48.77,32 48.77,16 49.78,14.99
  pour Top: 9.65,49.53 9.65,32.77 13.21,29.21 21.34,29.21 25.15,33.02 46.74,33.02 47.24,33.53 47.24,44.7 48.77,46.23 49.28,46.74 54.36,46.74 54.36,50.29 54.1,50.55 10.67,50.55
  pour Route2: 48.51,27.56 48.51,16.89 50.42,14.99 50.67,14.73 56.01,14.73 63.25,7.49 63.25,1.78 24,1.78 21.08,4.7 8.26,17.53 8.26,50.67 55.63,50.67 56.9,49.4 56.9,47.88 55.63,46.61 55.37,46.35 47.24,46.35 47.24,28.83
  pour Bottom: 66.04,17.14 66.04,50.8 1.91,50.8 0.64,49.53 0.64,1.91 63.5,1.91 63.5,10.16 61.59,12.06 61.59,15.88 62.23,16.51 65.41,16.51
  pour Route15: 63.5,3.81 63.5,9.53 55.88,17.14 55.88,20.32 49.53,26.67 49.53,30.48 50.55,31.5 52.07,31.5 60.71,31.5 65.79,36.58 66.04,36.83 66.04,41.66 56.9,50.8 55.37,50.8 9.65,50.8 4.06,45.21 4.06,14.99 17.27,1.78 63.25,1.78 63.5,2.03
ISO_COMN
  Top 0.152: C4.2 76.31,25.04 RCOML1-1.1
ISO_COMP
  Top 0.152: C3.2 76.26,31.34 RCOML-1.1
LDOIN
  Top 0.152: CLDOIN.1 62.46,36.77 | 62.46,36.77 62.46,35.5 59.73,32.77 52.86,32.77 51.02,30.93 50.32,30.93 50.31,30.94 IC2.47 | 62.46,36.77 T1.E
LDOIN-1
  Top 0.152: 98.58,9.33 CLDOIN-1.1
  Top 0.254: IC1.47 96,24.19 95.71,23.9 95.71,12.2 CLDOIN-1.1 | T2.E 98.58,9.33
N$2
  Top 0.152: 60.96,41.66 T1.C
  Top 0.406: 60.96,41.66 RNPN.2 CNPN.2
N$6
  Top 0.152: IC2.44 52.97,29.44 53.76,30.23 CNEG5V.1
N$46
  Top 0.152: RCOMH.1 71.83,31.39 C3.1
N$47
  Top 0.152: RCOMH1.1 71.83,25.15 C4.1
N$50
  Top 0.152: RCOML1.1 64.61,20.99 | 64.61,20.99 64.63,20.79 62.98,19.14 D1.1 | C5.2 64.62,20.98 64.61,20.99
N$51
  Top 0.152: RCOML.1 59.2,17.18 59.43,16.96 D1.2 62.98,16.36 63.95,15.39 C6.2
N$73
  Top 0.152: CNEG5V-1.1 94.39,25.14 94.93,25.68 IC1.44
N$92
  Top 0.152: T2.C 100.08,4.57
  Top 0.254: 100.08,4.57 100.84,4.57 103.04,6.77 CNPN-1.2 RNPN-1.2
N$97
  Top 0.152: D2.1 89.56,15.15 RCOMH-1.1
  Top 0.305: C1.1 91.14,15.08 RCOMH-1.1
N$98
  Top 0.152: D2.2 86.08,15.03 RCOMH1-1.1 84.71,11.96 C2.1
N$99
  Top 0.152: COMMH.2 91.19,8.48 91.19,9.29 C1.2
N$101
  Top 0.152: COMMH.4 84.68,8.41 C2.2
N$103
  Top 0.152: C5.1 67.91,18.03 71.49,14.45 COMML.2
N$104
  Top 0.152: 69.85,14.48 COMML.4 67.54,14.45 C6.1
NOT_USED_VC_CB  (via drill 0.35)
  Top 0.152: IC2.1 38.71,31.24 IC2.2 IC2.3 IC2.4 IC2.5 IC2.6 IC2.7 IC2.8 IC2.9 IC2.10 38.71,26.92 IC2.11 IC2.12 IC2.13 IC2.14 IC2.15
  Top 0.254: v37.08,24.38 37.14,24.44 IC2.15 | RBAT.2 38.71,26.92 | CBAT.2 38.59,31.11 38.71,31.24
  Bottom 0.305: CCB10.1 36.74,24.73 v37.08,24.38
NOT_USED_VC_CB_HIGH  (via drill 0.35)
  Top 0.152: IC1.1 IC1.2 IC1.3 IC1.4 IC1.5 IC1.6 IC1.7 IC1.8 IC1.9 IC1.10 IC1.11 IC1.12 IC1.13 IC1.14 IC1.15
  Top 0.203: v109.73,30.23 108.4,30.23 IC1.14
  Top 0.305: IC1.12 110.68,29.18 RBAT-1.2 | CBAT-1.2 108.41,23.62 IC1.1
  Bottom 0.203: CCB10-1.1 110.62,29.34 v109.73,30.23
NPNB
  Top 0.152: IC2.48 53.06,34.31 | 58.42,35.31 59.46,36.35 T1.B
  Top 0.254: 53.06,34.31 54.06,35.31 58.42,35.31
NPNB-1
  Top 0.152: IC1.48 96.88,19.2 98.15,17.93 98.15,14.12 101.58,10.69 T2.B
REFHP
  Top 0.152: CREFHP.1 52.91,20.45 52.91,24.3 51.28,25.94 IC2.37
REFHP-1
  Top 0.152: IC1.37 95.53,29.18 93.31,31.41 92.46,31.41 90.93,32.93 CREFHP-1.1
SRN
  Top 0.254: IC2.63 41.18,33.45 41.18,34.3 40.72,34.76 CCS.1
  Top 0.406: RCS2.1 37.88,34.42 CCS.1
SRN-IN
  Top 0.61: SR.3 29.76,34.54 RCS2.2
SRP
  Top 0.254: CCS.2 40.34,33.06 IC2.64
  Top 0.406: CCS.2 32.51,33.06 31.84,32.38 RCS1.1
SRP-IN
  Top 0.61: SR.4 29.73,32.54 RCS1.2
TEMP1  (via drill 0.35)
  Top 0.152: IC2.61 42.2,35.47 v41.78,35.89
  Top 0.203: RTHRM1.2 29.55,39.37 32.85,36.07 41.6,36.07 v41.78,35.89
  Top 0.305: RTHRM1.2 CTEMP1.1
  Route15 0.254: v41.78,35.89 41.27,35.38 41.27,22.48 39.37,20.57 39.37,17.65 LOW-IN.26
TEMP2  (via drill 0.35)
  Top 0.152: IC2.60 42.7,36.73 v42.49,36.93
  Top 0.203: v42.49,36.93 33.93,36.93 27.43,43.43 22.86,43.43 CTEMP2.1
  Top 0.305: RTHRM2.2 22.69,43.27 22.86,43.43
  Route15 0.254: LOW-IN.11 52.58,4.45 52.58,6.1 41.4,17.27 41.4,18.68 42.49,19.77 v42.49,36.93
TEMP3  (via drill 0.35)
  Top 0.152: IC2.59 43.2,37.77 v43.03,37.95
  Top 0.203: v43.03,37.95 34.7,37.95 28.19,44.45 24.47,44.45 23.46,45.47 RTHRM3.2
  Top 0.305: RTHRM3.2 CTEMP3.1
  Route15 0.254: v43.03,37.95 43.31,37.67 43.31,18.62 43.84,18.09 43.84,16.4 53.85,6.4 LOW-IN.27
TEMP4  (via drill 0.35)
  Top 0.152: IC2.58 43.7,38.83 v43.51,39.01
  Top 0.203: v43.51,39.01 35.41,39.01 28.28,46.14 RTHRM4.2
  Top 0.305: RTHRM4.2 CTEMP4.1
  Route15 0.254: v43.51,39.01 44.2,38.33 44.2,19.29 46,17.48 46,16.48 55.12,7.37 55.12,4.45 LOW-IN.12
TEMP5  (via drill 0.35)
  Top 0.152: IC2.57 44.2,39.85 v44.02,40.03
  Top 0.203: v44.02,40.03 38.37,40.03 CTEMP5.1
  Top 0.305: RTHRM5.2 CTEMP5.1
  Route15 0.254: v44.02,40.03 45.09,38.96 45.09,19.73 46.99,17.83 46.99,17.27 56.39,7.87 LOW-IN.28
TEMP6  (via drill 0.35)
  Top 0.152: IC2.56 44.7,40.97 v44.53,41.15
  Top 0.203: v44.53,41.15 41.31,41.15 RTHRM6.2
  Top 0.305: CTEMP6.1 RTHRM6.2
  Route15 0.254: v44.53,41.15 45.97,39.7 45.97,20.78 50.47,16.29 50.47,15.32 57.66,8.13 57.66,4.45 LOW-IN.13
TEMP7  (via drill 0.35)
  Top 0.152: IC2.55 45.2,41.95 v44.91,42.24
  Top 0.203: v44.91,42.24 44.29,42.24 40.47,46.06
  Top 0.305: RTHRM7.2 CTEMP7.1 40.47,46.06
  Route15 0.254: v44.91,42.24 46.74,40.41 46.74,22.86 52.07,17.53 52.07,15.49 58.93,8.64 LOW-IN.29
TEMP8  (via drill 0.35)
  Top 0.152: IC2.54 45.7,43.05 v45.47,43.28
  Top 0.203: v45.47,43.28 44.45,44.3 RTHRM8.2
  Top 0.305: CTEMP8.1 RTHRM8.2
  Route15 0.254: v45.47,43.28 47.5,41.25 47.5,30.73 50.29,27.94 50.29,21.59 60.2,11.68 60.2,4.45 LOW-IN.14
TEMP9  (via drill 0.35)
  Top 0.152: v110.87,20.5 105.28,20.5 104.87,20.91 IC1.61
  Top 0.203: RTHRM1-1.2 126.91,24.64 126.91,26.09 CTEMP9.1
  Top 0.254: v110.87,20.5 116,20.5 120.14,24.64 126.91,24.64
  Route15 0.254: HIGH-IN.26 92.08,44.2 106.93,44.2
  Route15 0.305: v110.87,20.5 112.06,21.69 112.06,39.06 106.93,44.2
TEMP10  (via drill 0.35)
  Top 0.152: v109.7,19.76 105.52,19.76 104.37,20.92 IC1.60
  Top 0.203: CTEMP10.1 126.91,20.24 RTHRM2-1.2
  Top 0.254: RTHRM2-1.2 120.11,22.48 117.45,19.81 109.75,19.81 v109.7,19.76
  Route15 0.254: HIGH-IN.11 89.15,47.12 89.15,45.47 91.19,43.43 104.24,43.43
  Route15 0.305: 104.24,43.43 111,36.68 111,26.67 109.7,25.38 v109.7,19.76
TEMP11  (via drill 0.35)
  Top 0.152: IC1.59 103.87,20.92 105.73,19.05 v108.61,19.05
  Top 0.203: CTEMP11.1 124.12,18.21 124.12,20.32 RTHRM3-1.2
  Top 0.254: v108.61,19.05 118.62,19.05 119.89,20.32 124.12,20.32
  Route15 0.254: HIGH-IN.27 87.88,44.45 89.66,42.67 101.09,42.67
  Route15 0.305: v108.61,19.05 107.8,19.86 107.8,35.97 101.09,42.67
TEMP12  (via drill 0.35)
  Top 0.152: IC1.58 103.37,20.92 106.45,17.83 v108.36,17.83
  Top 0.203: CTEMP12.1 121.32,16.43 RTHRM4-1.2
  Top 0.254: v108.36,17.83 118.71,17.83 119.29,18.41 RTHRM4-1.2
  Route15 0.254: HIGH-IN.12 86.61,47.12 86.61,44.2 88.9,41.91 99.57,41.91
  Route15 0.305: v108.36,17.83 105.66,20.52 105.66,35.81 99.57,41.91
TEMP13  (via drill 0.35)
  Top 0.152: IC1.57 102.87,20.92 107.17,16.61 v108.33,16.61
  Top 0.203: CTEMP13.1 118.33,14.86 RTHRM5-1.2
  Top 0.254: v108.33,16.61 118.2,16.61 RTHRM5-1.2
  Route15 0.254: HIGH-IN.28 85.34,44.2 88.39,41.15 97.54,41.15
  Route15 0.305: v108.33,16.61 103.12,21.82 103.12,35.56 97.54,41.15
TEMP14  (via drill 0.35)
  Top 0.152: IC1.56 102.37,20.7 107.8,15.27 v108.36,15.27
  Top 0.203: CTEMP14.1 115.74,12.62 RTHRM6-1.2
  Top 0.254: RTHRM6-1.2 115.18,15.27 v108.36,15.27
  Route15 0.254: HIGH-IN.13 84.07,47.12 84.07,44.2 87.88,40.39 95.6,40.39 95.65,40.34
  Route15 0.305: 95.65,40.34 101.85,34.13 101.85,21.77 v108.36,15.27
TEMP15  (via drill 0.35)
  Top 0.152: IC1.55 101.87,20.56 108.33,14.1 v108.33,14.05
  Top 0.203: CTEMP15.1 112.69,11.1 RTHRM7-1.2
  Top 0.254: RTHRM7-1.2 111.62,14.05 v108.33,14.05
  Route15 0.254: HIGH-IN.29 82.8,43.94 87.12,39.62 93.98,39.62
  Route15 0.305: v108.33,14.05 100.33,22.05 100.33,33.27 93.98,39.62
TEMP16  (via drill 0.35)
  Top 0.152: IC1.54 101.37,20.3 107.7,13.97 107.7,13.59 v108.58,12.7
  Top 0.203: CTEMP16.1 110.15,8.81 RTHRM8-1.2
  Top 0.254: RTHRM8-1.2 110.15,11.14 v108.58,12.7
  Route15 0.254: 95.56,34.29 85.6,34.29 81.53,38.35 81.53,47.12 HIGH-IN.14
  Route15 0.305: v108.58,12.7 99.06,22.23 99.06,30.79 95.56,34.29
TP  (via drill 0.35)
  Top 0.152: IC2.62 41.7,32.3 41.4,32 v40.13,32 | TP_NFAUL.TP 22.25,25.78 | 22.25,25.78 24,25.78 v24.13,25.65 | 22.23,25.81 22.25,25.78
  Top 0.305: TP3.TP 19.38,25.78 TP_NFAUL.TP
  Route15 0.152: v40.13,32 32.77,24.64 25.15,24.64 v24.13,25.65
TP-1
  Top 0.152: IC1.62 105.37,22.48 105.62,22.74 107.19,22.74 108.36,21.57 | 115.01,22.78 TP_NFAUL-1.TP
  Top 0.2: TP_NFAUL-1.TP 113.89,21.57 108.36,21.57
  Top 0.305: TP_NFAUL-1.TP 113.94,23.85 TP1.TP
TSREF
  Top 0.254: IC2.51 47.2,47.33
  Top 0.305: RTHRM1.1 RTHRM2.1 20.57,41.4 18.8,43.18 18.8,45.47 | 47.2,47.33 CTSREF.1 44.54,47.75 RTHRM8.1 42.51,49.78 38.1,49.78 | 18.8,45.47 18.8,48.26 20.32,49.78 28.19,49.78 | 38.1,49.78 36.32,49.78 | 36.32,49.78 30.23,49.78 | 30.23,49.78 28.19,49.78 | RTHRM6.1 36.32,49.78 | RTHRM7.1 38.35,49.53 38.1,49.78 | RTHRM3.1 18.8,45.47 | RTHRM4.1 28.19,49.78 | RTHRM5.1 30.23,49.78
TSREF-1  (via drill 0.35)
  Top 0.203: IC1.51 99.87,20.78 105.89,14.76 105.89,13.7 107.95,11.64 v107.95,9.4 107.95,8.34 CTSREF-1.1
  Top 0.305: RTHRM8-1.1 112.01,10.63 v112.01,9.4 | RTHRM7-1.1 114.39,12 v114.61,11.79 | RTHRM6-1.1 117.44,13.88 v117.6,13.72 | RTHRM5-1.1 120.03,15.51 v120.09,15.44 | RTHRM4-1.1 123.02,17.44 v123.19,17.27 | RTHRM3-1.1 125.82,19.47 v125.98,19.3 | RTHRM2-1.1 128.78,22.31 v128.78,21.08 | RTHRM1-1.1 129.67,24.51 v130.05,24.13
  Route15 0.305: v107.95,9.4 v112.01,9.4 112.22,9.4 v114.61,11.79 115.67,11.79 v117.6,13.72 118.36,13.72 v120.09,15.44 121.36,15.44 v123.19,17.27 123.95,17.27 v125.98,19.3 127,19.3 v128.78,21.08 130.05,22.35 v130.05,24.13
VC0
  Top 0.254: IC2.35 50.21,24.91 51.06,24.91 51.31,24.67 51.31,22.57 CVC1.2
  Top 0.406: CVC1.2 51.65,13.38 CVC0.1 49.4,11.14 RVC0.2
VC0-1
  Top 0.254: IC1.35 96.03,30.18 95.25,30.96 95.25,32.51 95,32.77 CVC0-1.1
  Top 0.305: CVC0-1.1 94.15,33.45 CVC1-1.2
  Top 0.406: CVC1-1.2 94.15,39.2 92.96,40.39 RVC0-1.2
VC1
  Top 0.254: IC2.33 50.19,22.46 CVC1.1
  Top 0.406: CVC1.1 49.95,21.17 50.51,20.61 CVC2.2 50.51,14.53 RVC1.2
VC1-1
  Top 0.254: IC1.33 96.88,33.79 CVC1-1.1
  Top 0.406: CVC1-1.1 95.16,35.51 CVC2-1.2 95.16,40.97 RVC1-1.2
VC1-IN
  Top 0.813: LOW-IN.24 46.23,8.55 RVC1.1
VC1-IN-1
  Top 0.813: RVC1-1.1 HIGH-IN.24
VC2
  Top 0.254: IC2.31 47.7,21.1 48.73,20.07 | 48.73,20.07 CVC2.1 | 48.73,20.07 48.99,19.81
  Top 0.406: 48.99,19.81 48.99,18.29 CVC3.2 49.24,15.77 44.35,10.88 RVC2.2
VC2-1
  Top 0.254: 96.86,36.63 CVC2-1.1 | IC1.31 99.37,34.49 97.23,36.63 97.01,36.63
  Top 0.406: CVC3-1.2 97.58,36.63 97.01,36.63 96.86,36.63
  Top 0.508: RVC2-1.2 98.16,41.2 CVC3-1.2
VC2-IN
  Top 0.152: 44.32,9.07 RVC2.1
  Top 0.813: LOW-IN.23 43.69,8.43 44.32,9.07
VC2-IN-1
  Top 0.813: RVC2-1.1 HIGH-IN.23
VC3
  Top 0.254: IC2.29 46.72,21.93 46.72,20.03 47.54,19.22 CVC3.1
  Top 0.406: CVC3.1 47.59,17.98 CVC4.2 47.59,15.88 42.59,10.88 RVC3.2
VC3-1
  Top 0.152: CVC3-1.1 99.93,37.14
  Top 0.254: 99.93,37.14 99.93,35.92 100.37,35.48 IC1.29
  Top 0.508: CVC3-1.1 99.73,37.34 CVC4-1.2 99.73,40.46 RVC3-1.2
VC3-IN
  Top 0.813: LOW-IN.22 41.15,8.65 RVC3.1
VC3-IN-1
  Top 0.813: RVC3-1.1 HIGH-IN.22
VC4
  Top 0.152: 39.14,10.9 RCV4.2
  Top 0.254: CVC4.1 45.7,16.16 IC2.27
  Top 0.406: CVC4.1 45.58,15.98 44.97,15.37 CVC5.2 44.54,14.82 42.16,12.45 40.68,12.45 39.14,10.9
VC4-1
  Top 0.254: IC1.27 101.37,37.57
  Top 0.508: 102.62,39.24 CVC5-1.2 102.78,40.97 RCV4-1.2 | 102.62,39.24 CVC4-1.1 | 101.37,37.57 101.37,37.99 102.62,39.24
VC4-IN
  Top 0.813: LOW-IN.21 38.61,8.68 RCV4.1
VC4-IN-1
  Top 0.813: RCV4-1.1 HIGH-IN.21
VC5
  Top 0.254: IC2.25 44.7,17.83 42.84,15.96 CVC5.1
  Top 0.406: CVC5.1 42.79,15.32 CVC6.2 41.49,14.86 39.59,12.95 38.14,12.95 RVC5.2
VC5-1
  Top 0.254: CVC5-1.1 104.48,38.94 102.37,36.82 IC1.25
  Top 0.406: CVC5-1.1 CVC6-1.2
  Top 0.508: CVC5-1.1 105.66,40.42 RVC5-1.2
VC5-IN
  Top 0.813: LOW-IN.20 RVC5.1
VC5-IN-1
  Top 0.813: RVC5-1.1 HIGH-IN.20
VC6
  Top 0.254: IC2.23 43.7,18.81 41.87,16.98 CVC7.2
  Top 0.406: CVC7.2 39.75,15.36 CVC6.1 37.67,15.32 33.53,11.18 RVC6.2
VC6-1
  Top 0.254: IC1.23 103.37,35.8 104.78,37.21 CVC7-1.2
  Top 0.508: CVC7-1.2 107.89,37.49 CVC6-1.1 107.89,41 RVC6-1.2
VC6-IN
  Top 0.813: LOW-IN.19 RVC6.1
VC6-IN-1
  Top 0.813: RVC6-1.1 HIGH-IN.19
VC7
  Top 0.254: IC2.21 42.7,19.84 41.4,18.54 39.89,18.54 CVC7.1
  Top 0.406: CVC7.1 39.41,18.34 37.35,18.34 CVC8.2 30.99,11.98 RCV7.2
VC7-1
  Top 0.152: 109.47,37.21 CVC7-1.1
  Top 0.254: IC1.21 104.37,34.77 105.92,36.32 108.58,36.32 109.47,37.21
  Top 0.508: CVC7-1.1 110.74,38.65 RCV7-1.2
  Top 1.016: CVC7-1.1 CVC8-1.2
VC7-IN
  Top 0.813: LOW-IN.18 RCV7.1
VC7-IN-1
  Top 0.813: RCV7-1.1 HIGH-IN.18
VC8
  Top 0.254: IC2.19 41.7,20.87 40.89,20.07 37.38,20.07 37.1,19.79 CVC8.1
  Top 0.406: CVC9.2 36.96,19.94 37.1,19.79
  Top 0.61: CVC8.1 35.39,19.65 28.45,12.7 RVC8.2
VC8-1
  Top 0.152: 112.36,37 CVC8-1.1
  Top 0.254: IC1.19 105.37,34.25 106.26,35.14 111.99,35.14 CVC9-1.2
  Top 0.406: CVC8-1.1 113.28,38.14 RVC8-1.2 | CVC9-1.2 112.39,36.96 112.36,37
VC8-IN
  Top 0.813: LOW-IN.17 RVC8.1
VC8-IN-1
  Top 0.813: RVC8-1.1 HIGH-IN.17
VC9
  Top 0.254: CVC9.1 37.45,22.2 40.45,22.2 IC2.17
  Top 0.61: CVC9.1 34.89,22.69 25.91,13.72 RVC9.2
VC9-1
  Top 0.254: IC1.17 106.47,33.27 111.82,33.27 CVC9-1.1
  Top 0.406: CVC9-1.1 115.82,37.27 RVC9-1.2
VC9-IN
  Top 0.61: RVC9.1 LOW-IN.16
VC9-IN-1
  Top 0.61: HIGH-IN.16 RVC9-1.1
(copper drawn outside any net)
  shapes: Top area x4

## Text on the board
tNames: BMS25 Daughterboard | Drake Vogelpohl | July 2024